# Altium schematic sheet EFR32G13_POWER_RESET.SchDoc (part 1 of 3)
size A4; Author: Induja N/Karthik R; SheetNumber: 5; SheetTotal: 7
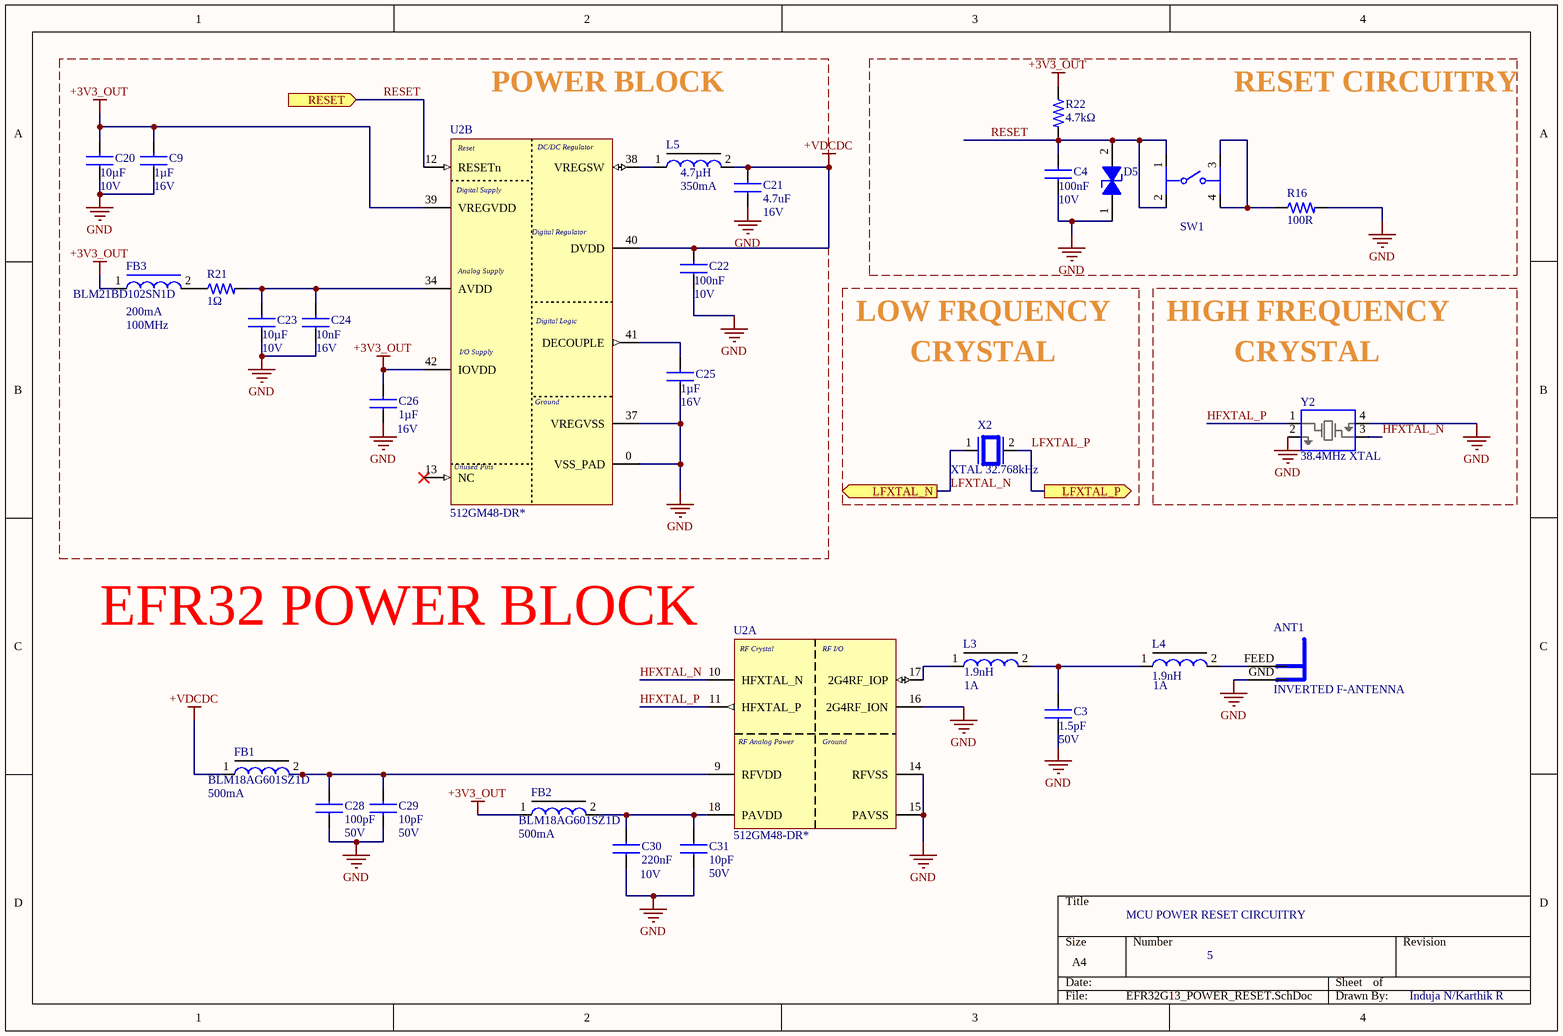
[diagram p0: EFR32G13_POWER_RESET.SchDoc]

## Parts
ANT1  INVERTED F-ANTENNA  [F_ANTENNA]  (net tie, no BOM)
C3  value 1.5pF  Rated DC Voltage (URdc): 50V  [Capacitor 0402]  (hidden comment: CAP 1.5pF 50V 0402)
C4  value 100nF  Voltage Rating (DC): 10V  [CAP_0603_1MM]  (hidden comment: CAP 0.1uF 0603)
C9  value 1µF  Voltage: 16V  [Capacitor 0603]  (hidden comment: CAP 1uF 0603)
C20  value 10µF  Voltage Rating: 10V  [CAP_0603_1MM]  (hidden comment: CAP 10uF 0603)
C21  16V  value 4.7uF  [CAPC1608X90N]
C22  value 100nF  Voltage Rating (DC): 10V  [CAP_0603_1MM]  (hidden comment: CAP 0.1uF 0603)
C23  value 10µF  Voltage Rating: 10V  [CAP_0603_1MM]  (hidden comment: CAP 10uF 0603)
C24  value 10nF  Voltage Rating (DC): 16V  [Capacitor 0603]  (hidden comment: CAP 10nF 0603)
C25  value 1µF  Voltage Rating (DC): 16V  [Capacitor 0603]  (hidden comment: CAP 1uF 0603)
C26  value 1µF  Voltage: 16V  [Capacitor 0603]  (hidden comment: CAP 1uF 0603)
C28  value 100pF  Voltage Rating (DC): 50V  [CAP_0603_1MM]  (hidden comment: CAP 100pF 0603)
C29  value 10pF  Rated DC Voltage (URdc): 50V  [Capacitor 0603]  (hidden comment: CAP 10pF 50V 0603)
C30  value 220nF  Voltage Rating: 10V  [Capacitor 0603]  (hidden comment: CAP 220nF 10V 0603)
C31  value 10pF  Rated DC Voltage (URdc): 50V  [Capacitor 0603]  (hidden comment: CAP 10pF 50V 0603)
D5  824032815  [WE-TVS_DFN1610-2L]  (value not drawn)
FB1  BLM18AG601SZ1D  Max Current Rating: 500mA  [Ferrite 0603]
FB2  BLM18AG601SZ1D  Max Current Rating: 500mA  [Ferrite 0603]
FB3  BLM21BD102SN1D  Current Rating: 200mA  Test Frequency: 100MHz  [FP-BLM21-0_2-t0_85-e0_5-IPC_A]
L3  value 1.9nH  Current Rating: 1A  [Ferrite 0402]  (hidden comment: IND 1.9nH)
L4  value 1.9nH  Current Rating: 1A  [Ferrite 0402]  (hidden comment: IND 1.9nH)
L5  value 4.7µH  Max Current Rating: 350mA  [Capacitor 0603]
R16  value 100R  [RES_0603_1608X06]
R21  value 1Ω  [RES_0603_1608X06]  (hidden comment: RES 1Ohm 0603)
R22  value 4.7kΩ  [RES_0603_1608X06]
SW1  (no value)  [SWITCH]
U2  512GM48-DR*  [QFN_48_7x7]  (parts A,B of 3)
X2  XTAL 32.768kHz  [XTAL_32.768KHZ-T]
Y2  38.4MHz XTAL  [XTAL 38.4MHz]

## Blocks framed on the sheet
POWER BLOCK: C9 C20-C26 FB3 L5 R21 U2
RESET CIRCUITRY: C4 D5 R16 R22 SW1

## Ports
LFXTAL_N (out, see EFR32BG13_INTERCONNECTS[3B]), LFXTAL_P (out, see EFR32BG13_INTERCONNECTS[3B]), RESET (in, see COMMUNICATION[1C])

## Nets
+3V3_OUT: C9.1 C20.1 C26.1 FB2.1 FB3.1 R22.1 U2.39(VREGVDD) U2.42(IOVDD)
+VDCDC: C21.1 C22.1 FB1.1 L5.2 U2.40(DVDD)
GND: ANT1.GND C3.2 C4.2 C9.2 C20.2 C21.2 C22.2 C23.2 C24.2 C25.2 C26.2 C28.2 C29.2 C30.2 C31.2 D5.1(I/O_1) R16.2 U2.0(VSS_PAD) U2.14(RFVSS) U2.15(PAVSS) U2.16(2G4RF_ION) U2.37(VREGVSS) Y2.2 Y2.4
HFXTAL_N: U2.10(HFXTAL_N) Y2.3
HFXTAL_P: U2.11(HFXTAL_P) Y2.1
LFXTAL_N: X2.1 ; port LFXTAL_N
LFXTAL_P: X2.2 ; port LFXTAL_P
RESET: C4.1 D5.2(GND) R22.2 SW1.1 SW1.2 U2.12(RESETn) ; port RESET
NetANT1_FEED: ANT1.FEED L4.2
NetC3_1: C3.1 L3.2 L4.1
NetC23_1: C23.1 C24.1 R21.2 U2.34(AVDD)
NetC25_1: C25.1 U2.41(DECOUPLE)
NetC28_1: C28.1 C29.1 FB1.2 U2.9(RFVDD)
NetC30_1: C30.1 C31.1 FB2.2 U2.18(PAVDD)
NetFB3_2: FB3.2 R21.1
NetL3_1: L3.1 U2.17(2G4RF_IOP)
NetL5_1: L5.1 U2.38(VREGSW)
NetR16_1: R16.1 SW1.3 SW1.4

Not connected (* = marked no-connect by the designer): U2 13(NC)*

## Notes on the sheet
- LOW FRQUENCY
- CRYSTAL
- HIGH FREQUENCY
- EFR32 POWER BLOCK
- MCU POWER RESET CIRCUITRY
- (in symbol EFR32BG13P732F512GM48-DR, part A) RF Crystal; RF I/O; RF Analog Power; Ground
- (in symbol EFR32BG13P732F512GM48-DR, part B) Reset; DC/DC Regulator; Digital Supply; Digital Regulator; Analog Supply; Digital Logic; I/O Supply; Ground; Unused Pins